# EAGLE design protoboard20mhzcrystal (EAGLE 5.06)
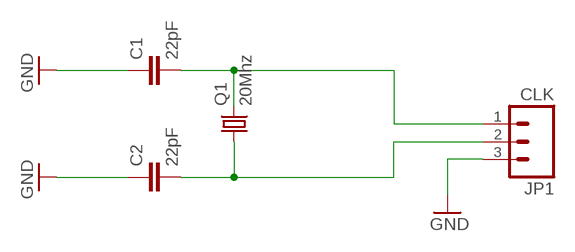
[diagram p0: schematic, sheet 1]

## Parts
C1  22pF  CAPPTH  [CAP-PTH-SMALL]
C2  22pF  CAPPTH  [CAP-PTH-SMALL]
JP1  CLK  M03PTH  [1X03]
Q1  20Mhz  CRYSTALHC49UV  [HC49U-V]

## Nets
GND: C1.1 C2.1 JP1.3
N$1: C1.2 JP1.1 Q1.2
N$2: C2.2 JP1.2 Q1.1

## Library data of the parts
C1 C2 = SparkFun-2009-11-03:CAP: Capacitor Standard 0603 ceramic capacitor, and 0.1" leaded capacitor.
JP1 = SparkFun-2009-11-03:M03: Header 3 Standard 3-pin 0.1" header. Use with straight break away headers (SKU : PRT-00116), right angle break away headers (PRT-00553), swiss pins (PRT-00743), machine pins (PRT-00117), and female headers (PRT-00115). Molex polarized connector foot print use with SKU : PRT-08232 with associated crimp pins and housings.
Q1 = SparkFun-2009-11-03:CRYSTAL: Crystals Various standard crystals. Proven footprints. Spark Fun Electronics SKU : COM-00534

## Board
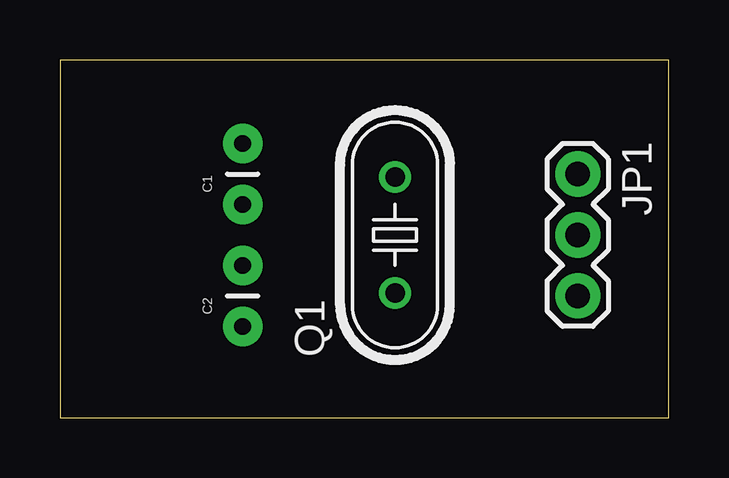
[diagram p1: board, top side]
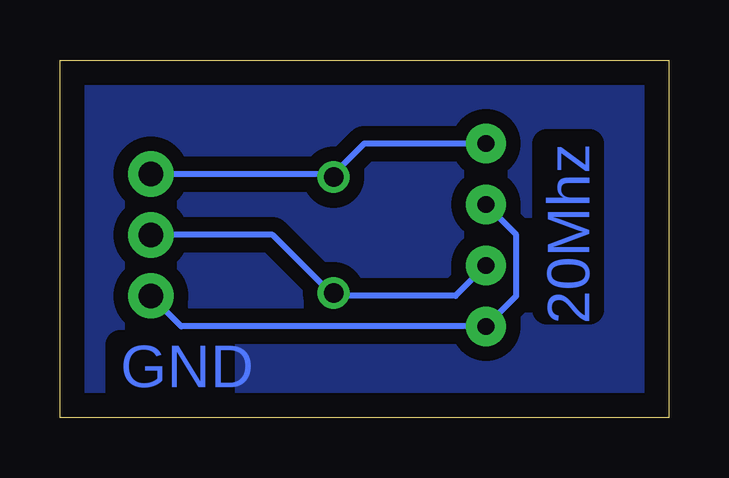
[diagram p2: board, bottom side, seen from below]

Size 25.38 x 14.91 mm. Coordinates in mm from the lower left corner, seen from the top.
Outline: 0,0 25.38,0 25.38,14.91 0,14.91 0,0
Copper layers (1*16): Top 0.035mm / dielectric 1.5mm / Bottom 0.035mm
Design rules "default": minimum track width 10mil, minimum drill 24mil, track to track 8mil, track to pad 8mil, pad to pad 8mil, via to via 8mil, smd to smd 8mil, copper to edge 40mil, drill to drill 8mil, minimum pad ring 10mil, minimum via ring 8mil, stop-mask expansion 4mil, vias tented up to drill 0mil, thermal gap 10mil

### Footprints (pad centres in the part's own frame; a part is rotated, then mirrored left to right if it is on the bottom)
CAP-PTH-SMALL = drill 0.7 pad 1.651 round: 1 0,0; 2 2.54,0
1X03 = drill 1.016 pad 1.88 round: 1 0,0; 2 2.54,0; 3 5.08,0
HC49U-V = drill 0.813 round: 1 -2.413,0; 2 2.413,0

### Placement (x,y rotation side)
C1  7.62,8.89 90 top
C2  7.62,3.81 90 top
JP1  21.59,10.16 270 top
Q1  13.97,7.62 90 top

### Tracks (layer width: path | path; a pad name or v marks a point on that pad's centre or on a via)
GND
  Bottom 0.254: JP1.3 20.32,3.81 C2.1 6.35,5.08 6.35,7.62 C1.1
N$1
  Bottom 0.254: 13.97,10.16 JP1.1 | C1.2 12.7,11.43 13.97,10.16 | 13.97,10.16 Q1.2
N$2
  Bottom 0.254: 13.97,5.08 8.89,5.08 C2.2 | JP1.2 16.51,7.62 13.97,5.08 | 13.97,5.08 Q1.1
N$4
  pour Bottom (isolate 0.61): 0.64,14.6 24.76,14.6 24.76,0.63 0.64,0.63

### Text on the board
Bottom: 20Mhz | GND